# Altium schematic sheet pcbLab.SchDoc
size A; SheetNumber: 1; SheetTotal: 1; SPICEModelCacheXRPYCGIM: <root> / <DocumentId>XRPYCGIM</DocumentId> / <CacheFrame Number="0"> / <Model Name="2n3904" Kind="MDL"> / <Text>*2N3904 / *Si 310mW  40V 200mA 300MHz pkg:TO-92B 1,2,3 / .MODEL 2N3904 NPN(IS=1.4E-14 BF=300 VAF=100 IKF=0.025 ISE=3E-13 / + BR=7.5 RC=2.4 CJE=4.5E-12 TF=4E-10 CJC=3.5E-12 TR=2.1E-8 XTB=1.5 KF=9E-16 )</Text> / </Model> / <Model Name="2n3906" Kind="MDL"> / <Text>*2N3906 / *Si 310mW  40V 200mA 250MHz pkg:TO-92B 1,2,3 / .MODEL 2N3906 PNP(IS=4E-14 BF=400 VAF=50 IKF=0.02 ISE=7E-15 NE=1.16 / + BR=7.5 RC=2.4 CJE=6.3E-12 VJE=0.75 TF=5E-10 CJC=5.8E-12 VJC=0.75 TR=2.3E-8 / + VJS=0.75 XTB=1.5 KF=6E-16 )</Text> / </Model> / </CacheFrame> / </root>
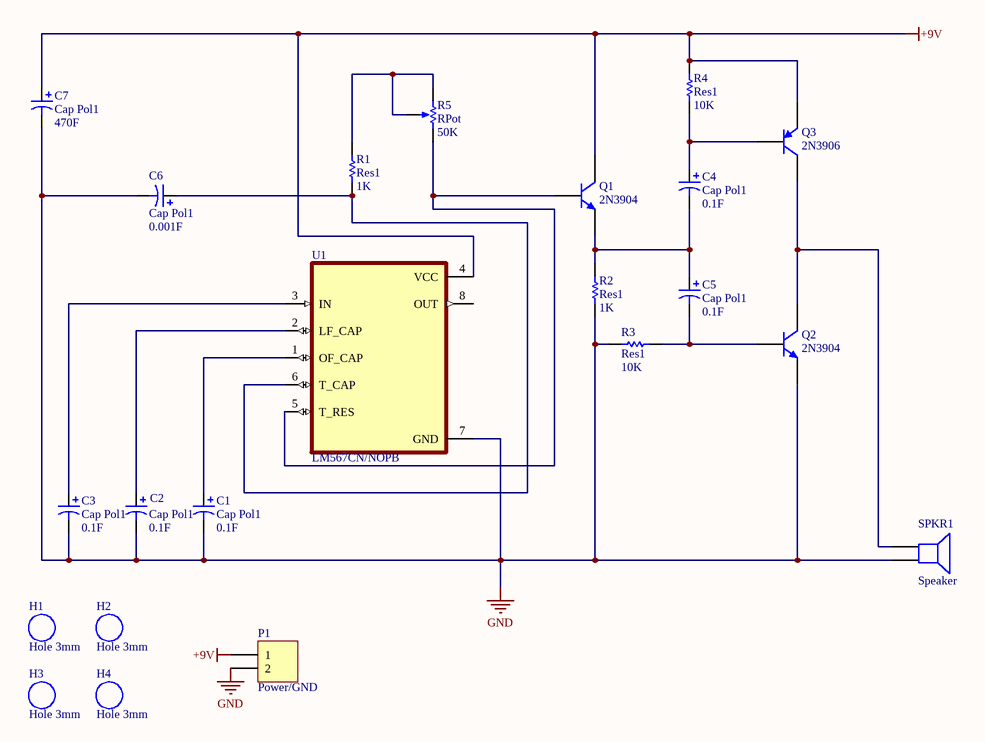
[diagram p0: pcbLab.SchDoc]

## Parts
C1  Cap Pol1  value 0.1F  [RAD-0.3]
C2  Cap Pol1  value 0.1F  [RAD-0.3]
C3  Cap Pol1  value 0.1F  [RAD-0.3]
C4  Cap Pol1  value 0.1F  [RAD-0.3]
C5  Cap Pol1  value 0.1F  [RAD-0.3]
C6  Cap Pol1  value 0.001F  [RAD-0.3]
C7  Cap Pol1  value 470F  [RAD-0.3]
H1  Hole 3mm  [Hole 3mm]
H2  Hole 3mm  [Hole 3mm]
H3  Hole 3mm  [Hole 3mm]
H4  Hole 3mm  [Hole 3mm]
P1  Power/GND  [HDR1X2]
Q1  2N3904  [TO-92A]
Q2  2N3904  [TO-92A]
Q3  2N3906  [TO-92A]
R1  Res1  value 1K  [AXIAL-0.3]
R2  Res1  value 1K  [AXIAL-0.3]
R3  Res1  value 10K  [AXIAL-0.3]
R4  Res1  value 10K  [AXIAL-0.3]
R5  RPot  value 50K  [VR5]
SPKR1  Speaker  [PIN2]
U1  LM567CN/NOPB  [DIP794W45P254L959H508Q8]

## Nets
+9V: C7.1 P1.1 Q1.3(C) Q3.1(E) R4.2 U1.4(VCC)
GND: C1.2 C2.2 C3.2 C6.2 C7.2 P1.2 Q2.1(E) R2.2 R3.1 SPKR1.2 U1.7(GND)
NetC1_1: C1.1 U1.1(OF_CAP)
NetC2_1: C2.1 U1.2(LF_CAP)
NetC3_1: C3.1 U1.3(IN)
NetC4_1: C4.1 Q3.2(B) R4.1
NetC4_2: C4.2 C5.1 Q1.1(E) R2.1
NetC5_2: C5.2 Q2.2(B) R3.2
NetC6_1: C6.1 R1.1 U1.6(T_CAP)
NetQ1_2: Q1.2(B) R5.2(BOT) U1.5(T_RES)
NetQ2_3: Q2.3(C) Q3.3(C) SPKR1.1
NetR1_2: R1.2 R5.1(TOP) R5.3(TAP)

Not connected (* = marked no-connect by the designer): U1 8(OUT)

## Library data of the parts
C1-C7 = Cap Pol1: Polarized Capacitor (Radial); Published: 8-Jun-2000; LatestRevisionDate: 17-Jul-2002; LatestRevisionNote: Re-released for DXP Platform.; PackageReference: RB7.6-15; Publisher: Altium Limited; PackageDescription: Polarized Capacitor (Radial); 2 Leads
P1 = Header 2: Header, 2-Pin; LatestRevisionDate: 17-Jul-2002; LatestRevisionNote: Re-released for DXP Platform.; Publisher: Altium Limited
Q1 Q2 = 2N3904: NPN General Purpose Amplifier; Published: 8-Jun-2000; LatestRevisionDate: 15-Jan-2003; LatestRevisionNote: PCB Footprint 'BCY-W3/D4.7' replaced; DatasheetVersion: 1997; PackageVersion: Sep-1998; PackageReference: TO-92A; Publisher: Altium Limited; PackageDescription: TO, Flat Index; 3 In-Line, Axial Leads; Body Dia. 4.5mm; Leads 0.51 x 0.48 mm (max); ComponentLink1Description: Manufacturer Link; ComponentLink1URL: http://www.fairchildsemi.com/; ComponentLink2Description: Datasheet; ComponentLink2URL: http://www.fairchildsemi.com/ds/2N%2F2N3904.pdf
Q3 = 2N3906: PNP General Purpose Amplifier; Published: 8-Jun-2000; LatestRevisionDate: 15-Jan-2003; LatestRevisionNote: PCB Footprint 'BCY-W3/D4.7' replaced; DatasheetVersion: 1997; PackageVersion: Sep-1998; PackageReference: TO-92A; Publisher: Altium Limited; PackageDescription: TO, Flat Index; 3 In-Line, Axial Leads; Body Dia. 4.5mm; Leads 0.51 x 0.48 mm (max); ComponentLink1Description: Manufacturer Link; ComponentLink1URL: http://www.fairchildsemi.com/; ComponentLink2Description: Datasheet; ComponentLink2URL: http://www.fairchildsemi.com/ds/2N%2F2N3906.pdf
R1-R4 = Res1: Resistor; Published: 8-Jun-2000; LatestRevisionDate: 17-Jul-2002; LatestRevisionNote: Re-released for DXP Platform.; PackageReference: AXIAL-0.3; Publisher: Altium Limited; PackageDescription: Axial Device, Thru-Hole; 2 Leads; 0.3 in Pin Spacing
R5 = RPot: Potentiometer; Sim Note: Enter the Resistance value and the set point into parameter fields.; Set Position: 0.5; Published: 8-Jun-2000; LatestRevisionDate: 17-Jul-2002; LatestRevisionNote: Re-released for DXP Platform.; PackageReference: VR5; Publisher: Altium Limited; PackageDescription: Variable Resistor, Thru-Hole; 3 Leads
SPKR1 = Speaker: Loudspeaker; Published: 24-Mar-1999; LatestRevisionDate: 17-Jul-2002; LatestRevisionNote: Re-released for DXP Platform.; PackageReference: PIN2; Publisher: Altium Limited
U1 = LM567CN/NOPB: Telecom IC Tone Decoder 8-PDIP; MF: Texas Instruments; Package: DIP-8 Texas Instruments; SnapEDA_Link: https://www.snapeda.com/parts/LM567CN/Texas%20Instruments/view-part/383132/?ref=snap; Value: *; MP: LM567CN; Availability: Unavailable; Price: None